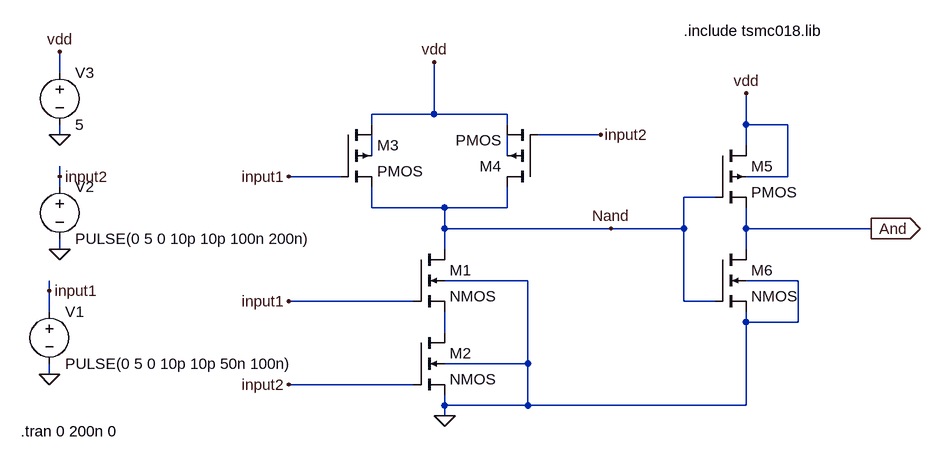
[diagram p0: schematic and_gate.asc]
and_gate.asc, the LTspice schematic file:
Version 4
SHEET 1 1016 680
WIRE -336 -64 -336 -96
WIRE 240 0 240 -80
WIRE 240 0 144 0
WIRE 352 0 240 0
WIRE 144 16 144 0
WIRE 352 16 352 0
WIRE 720 16 720 -32
WIRE 784 16 720 16
WIRE -336 32 -336 16
WIRE 496 32 400 32
WIRE 720 48 720 16
WIRE 144 64 144 32
WIRE 352 64 352 32
WIRE -336 96 -336 80
WIRE 96 96 16 96
WIRE 784 96 784 16
WIRE 784 96 720 96
WIRE -336 112 -336 96
WIRE 672 128 624 128
WIRE 144 144 144 112
WIRE 256 144 144 144
WIRE 352 144 352 112
WIRE 352 144 256 144
WIRE 256 176 256 144
WIRE 512 176 256 176
WIRE 624 176 624 128
WIRE 624 176 512 176
WIRE 720 176 720 144
WIRE 912 176 720 176
WIRE -336 208 -336 192
WIRE 256 208 256 176
WIRE 720 208 720 176
WIRE 384 256 256 256
WIRE 800 256 720 256
WIRE -352 272 -352 256
WIRE 208 288 16 288
WIRE 624 288 624 176
WIRE 672 288 624 288
WIRE -352 304 -352 272
WIRE 720 320 720 304
WIRE 800 320 800 256
WIRE 800 320 720 320
WIRE 256 336 256 304
WIRE 384 384 384 256
WIRE 384 384 256 384
WIRE -352 400 -352 384
WIRE 208 416 16 416
WIRE 256 448 256 432
WIRE 384 448 384 384
WIRE 384 448 256 448
WIRE 720 448 720 320
WIRE 720 448 384 448
WIRE 256 464 256 448
FLAG 256 464 0
FLAG 16 96 input1
FLAG 16 288 input1
FLAG 16 416 input2
FLAG 496 32 input2
FLAG 512 176 Nand
FLAG -352 400 0
FLAG -336 208 0
FLAG -336 32 0
FLAG -352 272 input1
FLAG -336 96 input2
FLAG -336 -96 vdd
FLAG 240 -80 vdd
FLAG 720 -32 vdd
FLAG 912 176 And
IOPIN 912 176 Out
SYMBOL nmos4 208 208 R0
SYMATTR InstName M1
SYMATTR Value2 l=1.8u w=2u
SYMBOL nmos4 208 336 R0
SYMATTR InstName M2
SYMATTR Value2 l=1.8u w=2u
SYMBOL pmos4 96 16 R0
SYMATTR InstName M3
SYMATTR Value2 l=1.18u w=2.18u
SYMBOL pmos4 400 112 R180
SYMATTR InstName M4
SYMATTR Value2 l=1.8u w=2.18u
SYMBOL pmos4 672 48 R0
SYMATTR InstName M5
SYMATTR Value2 l=1.8u w=2.18u
SYMBOL nmos4 672 208 R0
SYMATTR InstName M6
SYMATTR Value2 l=1.8u w=1u
SYMBOL voltage -352 288 R0
WINDOW 123 0 0 Left 0
WINDOW 39 0 0 Left 0
SYMATTR InstName V1
SYMATTR Value PULSE(0 5 0 10p 10p 50n 100n)
SYMBOL voltage -336 96 R0
WINDOW 123 0 0 Left 0
WINDOW 39 0 0 Left 0
SYMATTR InstName V2
SYMATTR Value PULSE(0 5 0 10p 10p 100n 200n)
SYMBOL voltage -336 -80 R0
WINDOW 123 0 0 Left 0
WINDOW 39 0 0 Left 0
SYMATTR InstName V3
SYMATTR Value 5
TEXT 624 -128 Left 2 !.include tsmc018.lib
TEXT -396 488 Left 2 !.tran 0 200n 0

The netlist it stands for:
* and_gate.asc
M1 Nand input1 N003 0 NMOS l=1.8u w=2u
M2 N003 input2 0 0 NMOS l=1.8u w=2u
M3 vdd input1 Nand N001 PMOS l=1.18u w=2.18u
M4 Nand input2 vdd N002 PMOS l=1.8u w=2.18u
M5 vdd Nand And vdd PMOS l=1.8u w=2.18u
M6 And Nand 0 0 NMOS l=1.8u w=1u
V1 input1 0 PULSE(0 5 0 10p 10p 50n 100n)
V2 input2 0 PULSE(0 5 0 10p 10p 100n 200n)
V3 vdd 0 5
.model NMOS NMOS
.model PMOS PMOS
.lib standard.mos
.include tsmc018.lib
.tran 0 200n 0
.backanno
.end